# EAGLE schematic one-stage-full-wave-cockcroft-walton (EAGLE 9.5.0)
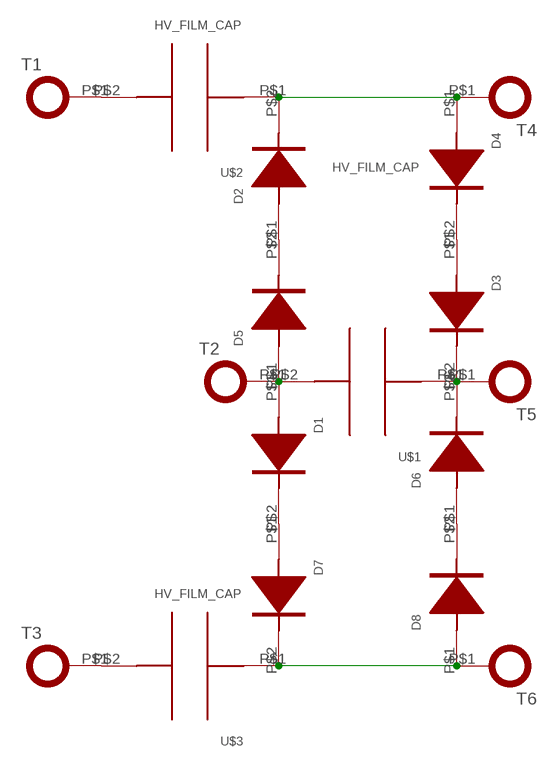
[diagram p0: schematic, sheet 1]

## Parts
D1  DIODE_14MM  [DIODE_14]
D2  DIODE_14MM  [DIODE_14]
D3  DIODE_14MM  [DIODE_14]
D4  DIODE_14MM  [DIODE_14]
D5  DIODE_14MM  [DIODE_14]
D6  DIODE_14MM  [DIODE_14]
D7  DIODE_14MM  [DIODE_14]
D8  DIODE_14MM  [DIODE_14]
T1  TERMINAL_M6  [LUG_SQUARE_M6]
T2  TERMINAL_M6  [LUG_SQUARE_M6]
T3  TERMINAL_M6  [LUG_SQUARE_M6]
T4  TERMINAL_M6  [LUG_SQUARE_M6]
T5  TERMINAL_M6  [LUG_SQUARE_M6]
T6  TERMINAL_M6  [LUG_SQUARE_M6]
U$1  HV_FILM_CAP  [HV_FILM_CAP]
U$2  HV_FILM_CAP  [HV_FILM_CAP]
U$3  HV_FILM_CAP  [HV_FILM_CAP]

## Nets
N$1: D1.P$1(ANODE) D5.P$1(ANODE) T2.P$1 U$1.P$2
N$2: D2.P$1(ANODE) D5.P$2(CATHODE)
N$3: D2.P$2(CATHODE) D4.P$1(ANODE) T4.P$1 U$2.P$1
N$5: D3.P$1(ANODE) D4.P$2(CATHODE)
N$6: T3.P$1 U$3.P$2
N$7: T1.P$1 U$2.P$2
N$8: D7.P$2(CATHODE) D8.P$1(ANODE) T6.P$1 U$3.P$1
N$9: D3.P$2(CATHODE) D6.P$2(CATHODE) T5.P$1 U$1.P$1
N$10: D1.P$2(CATHODE) D7.P$1(ANODE)
N$11: D6.P$1(ANODE) D8.P$2(CATHODE)

## Library data of the parts
D1-D8 = guParts:DIODE_14MM: Generic diode with 14mm footprint.
T1-T6 = guParts:TERMINAL_M6: Attachment for an M6 terminal
U$1-U$3 = guParts:HV_FILM_CAP: A 50 nF film capacitor rated for 30 kV.